# Altium schematic sheet etapa1_suma.SchDoc
size A4
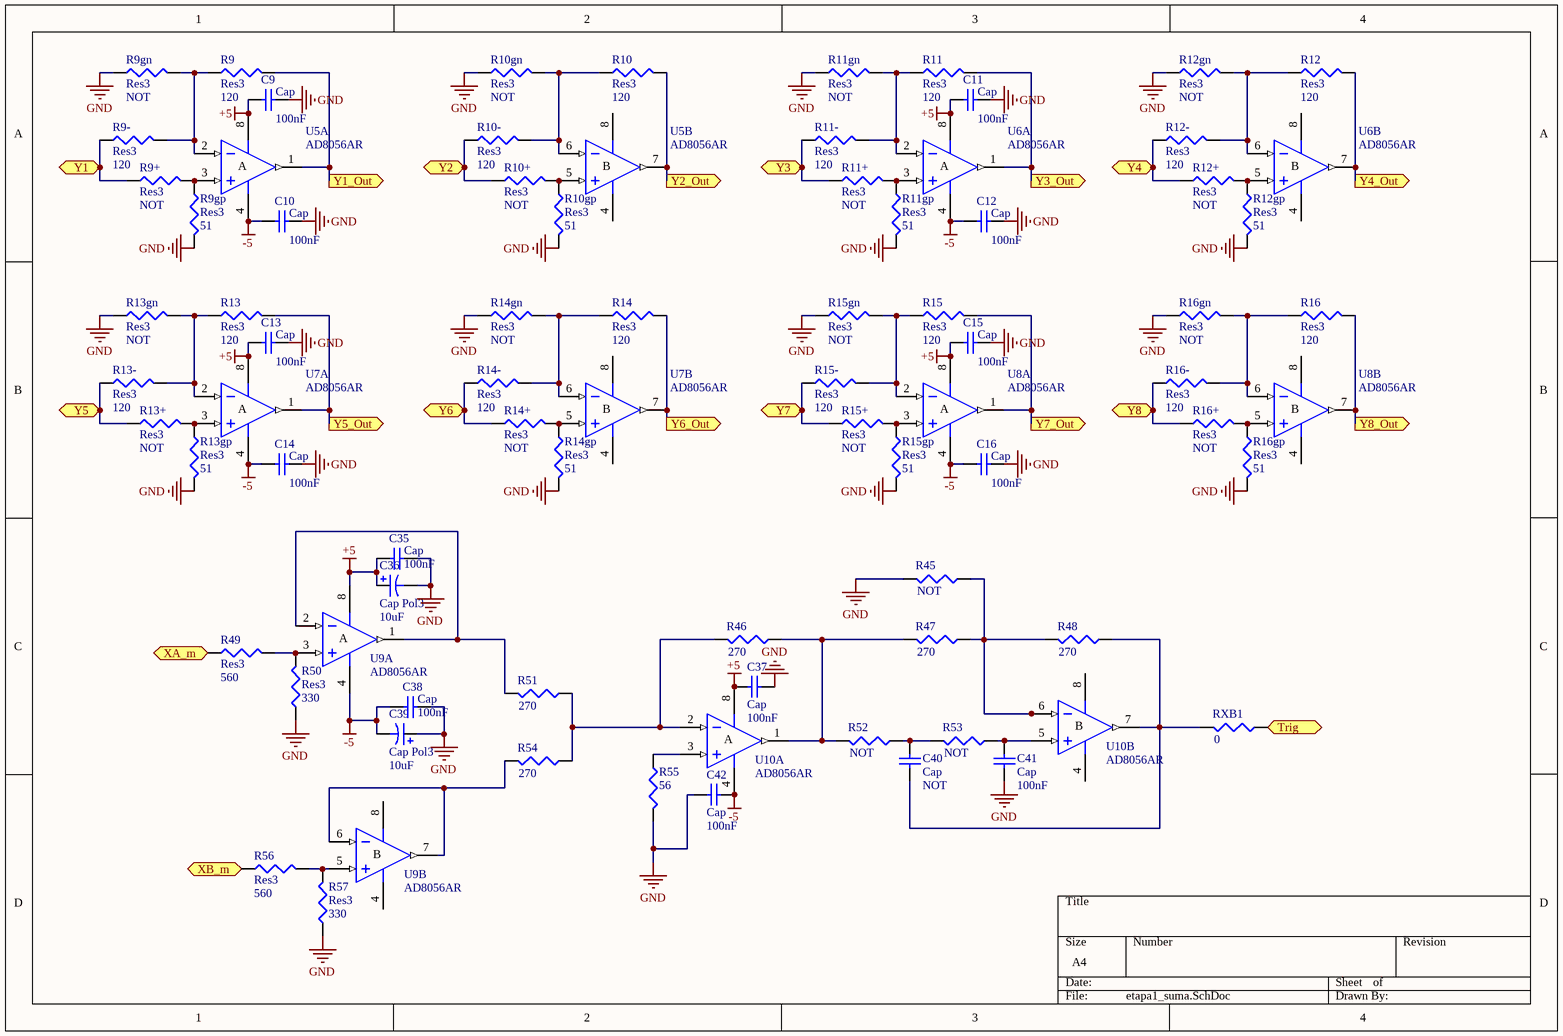
[diagram p0: etapa1_suma.SchDoc]

## Parts
C9  Cap  value 100nF  [1608[0603]]
C10  Cap  value 100nF  [1608[0603]]
C11  Cap  value 100nF  [1608[0603]]
C12  Cap  value 100nF  [1608[0603]]
C13  Cap  value 100nF  [1608[0603]]
C14  Cap  value 100nF  [1608[0603]]
C15  Cap  value 100nF  [1608[0603]]
C16  Cap  value 100nF  [1608[0603]]
C35  Cap  value 100nF  [6-0805_N]
C36  Cap Pol3  value 10uF  [6-0805_N]
C37  Cap  value 100nF  [1608[0603]]
C38  Cap  value 100nF  [6-0805_N]
C39  Cap Pol3  value 10uF  [6-0805_N]
C40  Cap  value NOT  [1608[0603]]
C41  Cap  value 100nF  [1608[0603]]
C42  Cap  value 100nF  [1608[0603]]
R9  Res3  value 120  [0402]
R9+  Res3  value NOT  [0402]
R9-  Res3  value 120  [0402]
R9gn  Res3  value NOT  [0402]
R9gp  Res3  value 51  [0402]
R10  Res3  value 120  [0402]
R10+  Res3  value NOT  [0402]
R10-  Res3  value 120  [0402]
R10gn  Res3  value NOT  [0402]
R10gp  Res3  value 51  [0402]
R11  Res3  value 120  [0402]
R11+  Res3  value NOT  [0402]
R11-  Res3  value 120  [0402]
R11gn  Res3  value NOT  [0402]
R11gp  Res3  value 51  [0402]
R12  Res3  value 120  [0402]
R12+  Res3  value NOT  [0402]
R12-  Res3  value 120  [0402]
R12gn  Res3  value NOT  [0402]
R12gp  Res3  value 51  [0402]
R13  Res3  value 120  [0402]
R13+  Res3  value NOT  [0402]
R13-  Res3  value 120  [0402]
R13gn  Res3  value NOT  [0402]
R13gp  Res3  value 51  [0402]
R14  Res3  value 120  [0402]
R14+  Res3  value NOT  [0402]
R14-  Res3  value 120  [0402]
R14gn  Res3  value NOT  [0402]
R14gp  Res3  value 51  [0402]
R15  Res3  value 120  [0402]
R15+  Res3  value NOT  [0402]
R15-  Res3  value 120  [0402]
R15gn  Res3  value NOT  [0402]
R15gp  Res3  value 51  [0402]
R16  Res3  value 120  [0402]
R16+  Res3  value NOT  [0402]
R16-  Res3  value 120  [0402]
R16gn  Res3  value NOT  [0402]
R16gp  Res3  value 51  [0402]
R45  value NOT  [J1-0603]  (hidden comment: Res3)
R46  value 270  [J1-0603]  (hidden comment: Res3)
R47  value 270  [J1-0603]  (hidden comment: Res3)
R48  value 270  [J1-0603]  (hidden comment: Res3)
R49  Res3  value 560  [J1-0603]
R50  Res3  value 330  [J1-0603]
R51  value 270  [J1-0603]  (hidden comment: Res3)
R52  value NOT  [J1-0603]  (hidden comment: Res3)
R53  value NOT  [J1-0603]  (hidden comment: Res3)
R54  value 270  [J1-0603]  (hidden comment: Res3)
R55  value 56  [J1-0603]  (hidden comment: Res3)
R56  Res3  value 560  [J1-0603]
R57  Res3  value 330  [J1-0603]
RXB1  value 0  [J1-0603]  (hidden comment: Res3)
U5  AD8056AR  [RM-8]  (parts A,B of 2)
U6  AD8056AR  [RM-8]  (parts A,B of 2)
U7  AD8056AR  [RM-8]  (parts A,B of 2)
U8  AD8056AR  [RM-8]  (parts A,B of 2)
U9  AD8056AR  [RM-8]  (parts A,B of 2)
U10  AD8056AR  [RM-8]  (parts A,B of 2)

## Ports
Trig (out), XA_m (out), XB_m (out), Y1 (in), Y1_Out (out), Y2 (in), Y2_Out (out), Y3 (in), Y3_Out (out), Y4 (in), Y4_Out (out), Y5 (in), Y5_Out (out), Y6 (in), Y6_Out (out), Y7 (in), Y7_Out (out), Y8 (in), Y8_Out (out)

## Nets
+5: C9.2 C11.2 C13.2 C15.2 C35.2 C36.1 C37.1 U5.8(V+) U6.8(V+) U7.8(V+) U8.8(V+) U9.8(V+) U10.8(V+)
-5: C10.2 C12.2 C14.2 C16.2 C38.2 C39.2 C42.2 U5.4(V-) U6.4(V-) U7.4(V-) U8.4(V-) U9.4(V-) U10.4(V-)
GND: C9.1 C10.1 C11.1 C12.1 C13.1 C14.1 C15.1 C16.1 C35.1 C36.2 C37.2 C38.1 C39.1 C41.2 C42.1 R9gn.1 R9gp.2 R10gn.1 R10gp.2 R11gn.1 R11gp.2 R12gn.1 R12gp.2 R13gn.1 R13gp.2 R14gn.1 R14gp.2 R15gn.1 R15gp.2 R16gn.1 R16gp.2 R45.2 R50.1 R55.2 R57.1
Trig: RXB1.1 ; port Trig
XA_m: R49.1 ; port XA_m
XB_m: R56.1 ; port XB_m
Y1: R9+.1 R9-.1 ; port Y1
Y1_Out: R9.2 U5.1(OUT) ; port Y1_Out
Y2: R10+.1 R10-.1 ; port Y2
Y2_Out: R10.2 U5.7(OUT) ; port Y2_Out
Y3: R11+.1 R11-.1 ; port Y3
Y3_Out: R11.2 U6.1(OUT) ; port Y3_Out
Y4: R12+.1 R12-.1 ; port Y4
Y4_Out: R12.2 U6.7(OUT) ; port Y4_Out
Y5: R13+.1 R13-.1 ; port Y5
Y5_Out: R13.2 U7.1(OUT) ; port Y5_Out
Y6: R14+.1 R14-.1 ; port Y6
Y6_Out: R14.2 U7.7(OUT) ; port Y6_Out
Y7: R15+.1 R15-.1 ; port Y7
Y7_Out: R15.2 U8.1(OUT) ; port Y7_Out
Y8: R16+.1 R16-.1 ; port Y8
Y8_Out: R16.2 U8.7(OUT) ; port Y8_Out
NetC40_1: C40.1 R52.1 R53.2
NetC40_2: C40.2 R48.1 RXB1.2 U10.7(OUT)
NetC41_1: C41.1 R53.1 U10.5(IN+)
NetR9+_2: R9+.2 R9gp.1 U5.3(IN+)
NetR9_1: R9.1 R9-.2 R9gn.2 U5.2(IN-)
NetR10+_2: R10+.2 R10gp.1 U5.5(IN+)
NetR10_1: R10.1 R10-.2 R10gn.2 U5.6(IN-)
NetR11+_2: R11+.2 R11gp.1 U6.3(IN+)
NetR11_1: R11.1 R11-.2 R11gn.2 U6.2(IN-)
NetR12+_2: R12+.2 R12gp.1 U6.5(IN+)
NetR12_1: R12.1 R12-.2 R12gn.2 U6.6(IN-)
NetR13+_2: R13+.2 R13gp.1 U7.3(IN+)
NetR13_1: R13.1 R13-.2 R13gn.2 U7.2(IN-)
NetR14+_2: R14+.2 R14gp.1 U7.5(IN+)
NetR14_1: R14.1 R14-.2 R14gn.2 U7.6(IN-)
NetR15+_2: R15+.2 R15gp.1 U8.3(IN+)
NetR15_1: R15.1 R15-.2 R15gn.2 U8.2(IN-)
NetR16+_2: R16+.2 R16gp.1 U8.5(IN+)
NetR16_1: R16.1 R16-.2 R16gn.2 U8.6(IN-)
NetR45_1: R45.1 R47.1 R48.2 U10.6(IN-)
NetR46_1: R46.1 R47.2 R52.2 U10.1(OUT)
NetR46_2: R46.2 R51.1 R54.1 U10.2(IN-)
NetR49_2: R49.2 R50.2 U9.3(IN+)
NetR51_2: R51.2 U9.1(OUT) U9.2(IN-)
NetR54_2: R54.2 U9.6(IN-) U9.7(OUT)
NetR55_1: R55.1 U10.3(IN+)
NetR56_2: R56.2 R57.2 U9.5(IN+)

## Notes on the sheet
- (in symbol AD8056AR, part A) A
- (in symbol AD8056AR, part B) B

## Library data of the parts
C9-C16 C35 C37 C38 C40-C42 = Cap: Capacitor; Published: 8-Jun-2000; LatestRevisionDate: 17-Jul-2002; LatestRevisionNote: Re-released for DXP Platform.; PackageReference: RAD-0.3; Publisher: Altium Limited; PackageDescription: Radial Cap, Thru-Hole; 2 Leads; 0.3 in Pin Spacing
C36 C39 = Cap Pol3: Polarized Capacitor (Surface Mount); Published: 8-Jun-2000; LatestRevisionDate: 29-May-2009; LatestRevisionNote: IPC-7351 Footprint Added.; PackageReference: C0805; Publisher: Altium Limited; PackageDescription: Chip Capacitor
R9 R9+ R9- R9gn R9gp R10 R10+ R10- R10gn R10gp R11 R11+ R11- R11gn R11gp R12 R12+ R12- R12gn R12gp R13 R13+ R13- R13gn R13gp R14 R14+ R14- R14gn R14gp R15 R15+ R15- R15gn R15gp R16 R16+ R16- R16gn R16gp R45-R57 RXB1 = Res3: Resistor; Published: 8-Jun-2000; LatestRevisionDate: 29-May-2009; LatestRevisionNote: IPC-7351 Footprint Added.; PackageReference: J1-0603; Publisher: Altium Limited; PackageDescription: Chip Resistor
U5-U10 = AD8056AR: Low Cost, 300MHz Voltage Feedback Amplifier; Published: 8-Jun-2000; LatestRevisionDate: 13-Apr-2006; LatestRevisionNote: IPC-7351 Footprint Added.; DatasheetVersion: REV. 0 1997; PackageVersion: revA; PackageReference: SO-8; Publisher: Altium Limited; PackageDescription: 8-Pin Small Outline Integrated Circuit 1.27 mm Pitch; Code_JEDEC: MS-012-AA; Code_IPC: SOIC127P600-8; ComponentLink1Description: Manufacturer Link; ComponentLink1URL: http://www.analog.com/en/prod/0,,759_786_AD8055%2C00.html; ComponentLink2Description: Datasheet; ComponentLink2URL: http://www.analog.com/UploadedFiles/Data_Sheets/40402558757264AD8055_6_i.pdf